# EAGLE schematic midi5v (EAGLE 6.6.0)
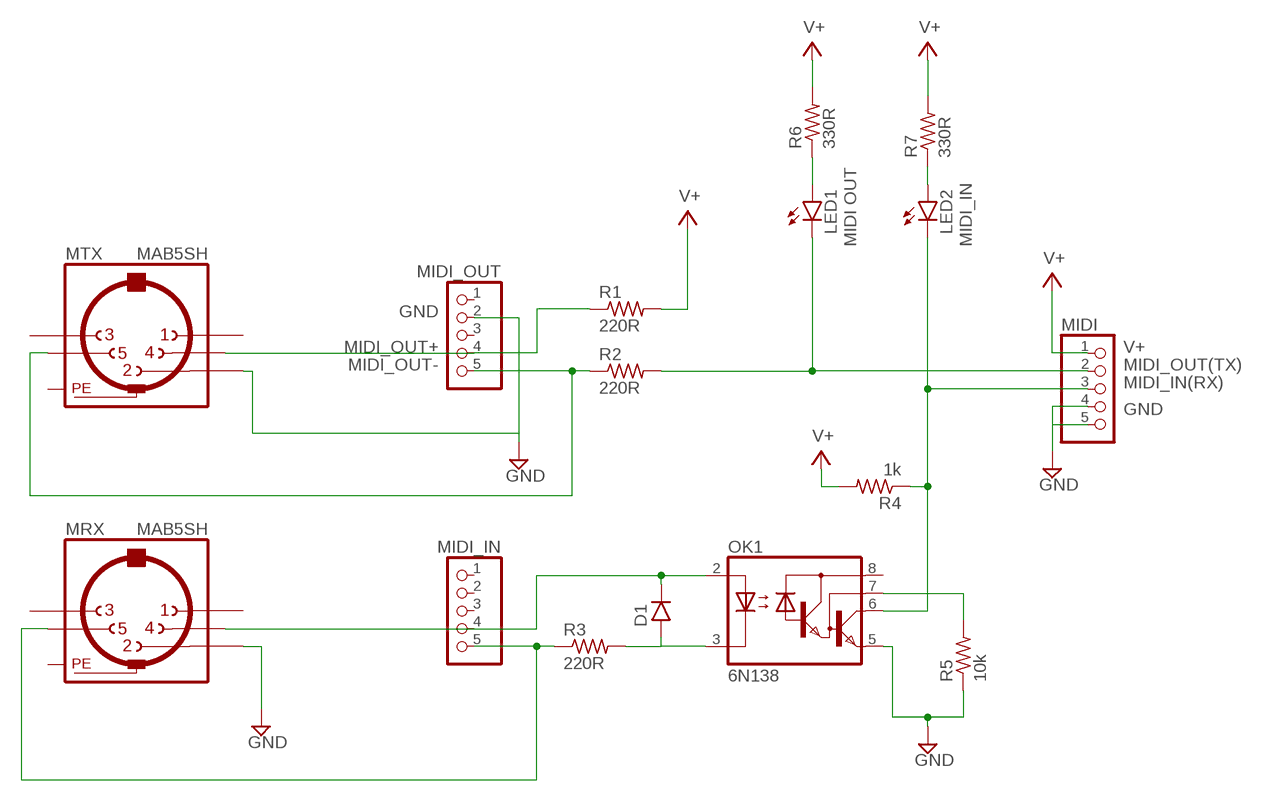
[diagram p0: schematic, sheet 1]

## Parts
D1  1N4148-2  [DO35-2]
LED1  LED3MM  [LED3MM]
LED2  LED3MM  [LED3MM]
MIDI  PINHD-1X5  [1X05]
MIDI_IN  PINHD-1X5  [1X05]
MIDI_OUT  PINHD-1X5  [1X05]
MRX  MAB5SH  [MAB5SH]
MTX  MAB5SH  [MAB5SH]
OK1  6N138  [DIL08]
R1  220R  6MM.3  [R0207/3]
R2  220R  6MM.3  [R0207/3]
R3  220R  6MM.3  [R0207/3]
R4  1k  6MM.3  [R0207/3]
R5  10k  6MM.3  [R0207/3]
R6  330R  6MM.3  [R0207/3]
R7  330R  6MM.3  [R0207/3]

## Nets
GND: MIDI.4 MIDI.5 MIDI_OUT.2 MRX.2 MTX.2 OK1.5(GND) R5.1
MIDI_IN(RX): LED2.K(C) MIDI.3 OK1.6(VO) R4.1
MIDI_OUT(TX): LED1.K(C) MIDI.2 R2.2
MIDI_OUT+: MIDI_OUT.4 MTX.4 R1.1
MIDI_OUT-: MIDI_OUT.5 MTX.5 R2.1
N$3: MIDI_IN.5 MRX.5 R3.1
N$4: D1.A OK1.3(C) R3.2
N$5: D1.C MIDI_IN.4 MRX.4 OK1.2(A)
N$6: LED1.A R6.1
N$7: OK1.7(VB) R5.2
N$8: LED2.A R7.1
V+: MIDI.1 R1.2 R4.2 R6.2 R7.2
Unconnected: MIDI_IN.1 MIDI_IN.2 MIDI_IN.3 MIDI_OUT.1 MIDI_OUT.3 MRX.1 MRX.3 MTX.1 MTX.3 OK1.8(VCC)

## Notes on the sheet
- MIDI OUT | MIDI_IN

## Power pins joined to a net without a drawn wire
PE: MRX.PE MRX.PE@(PE) MTX.PE MTX.PE@(PE)

## Library data of the parts
D1 = gm-diodes:1N4148: Fast Switching Diode DO-35 glass case a.k.a. 1N914
LED1 LED2 = gm-diodes:LED
MIDI MIDI_IN MIDI_OUT = pinhead:PINHD-1X5: PIN HEADER
MRX MTX = jaapie:MAB5SH: Female CONNECTOR 5 pins 90 deg. with shield, horizontal (DIN 41524); OC_FARNELL: 809883; OC_NEWARK: unknown
OK1 = optocoupler:6N138: MOTOROLA OPTO COUPLER; MF: VISHAY/TELEFUNKEN; MPN: 6N138; OC_FARNELL: 9860150; OC_NEWARK: 35K5294
R1-R7 = gm-resistors:6MM: 6mm Resistors Leads spaced 1-6 holes apart for 0.1" perfboard. Suitable for 1/4 watt resistors.